# EAGLE board MotherBoard (EAGLE 5.01), part 1 of 2
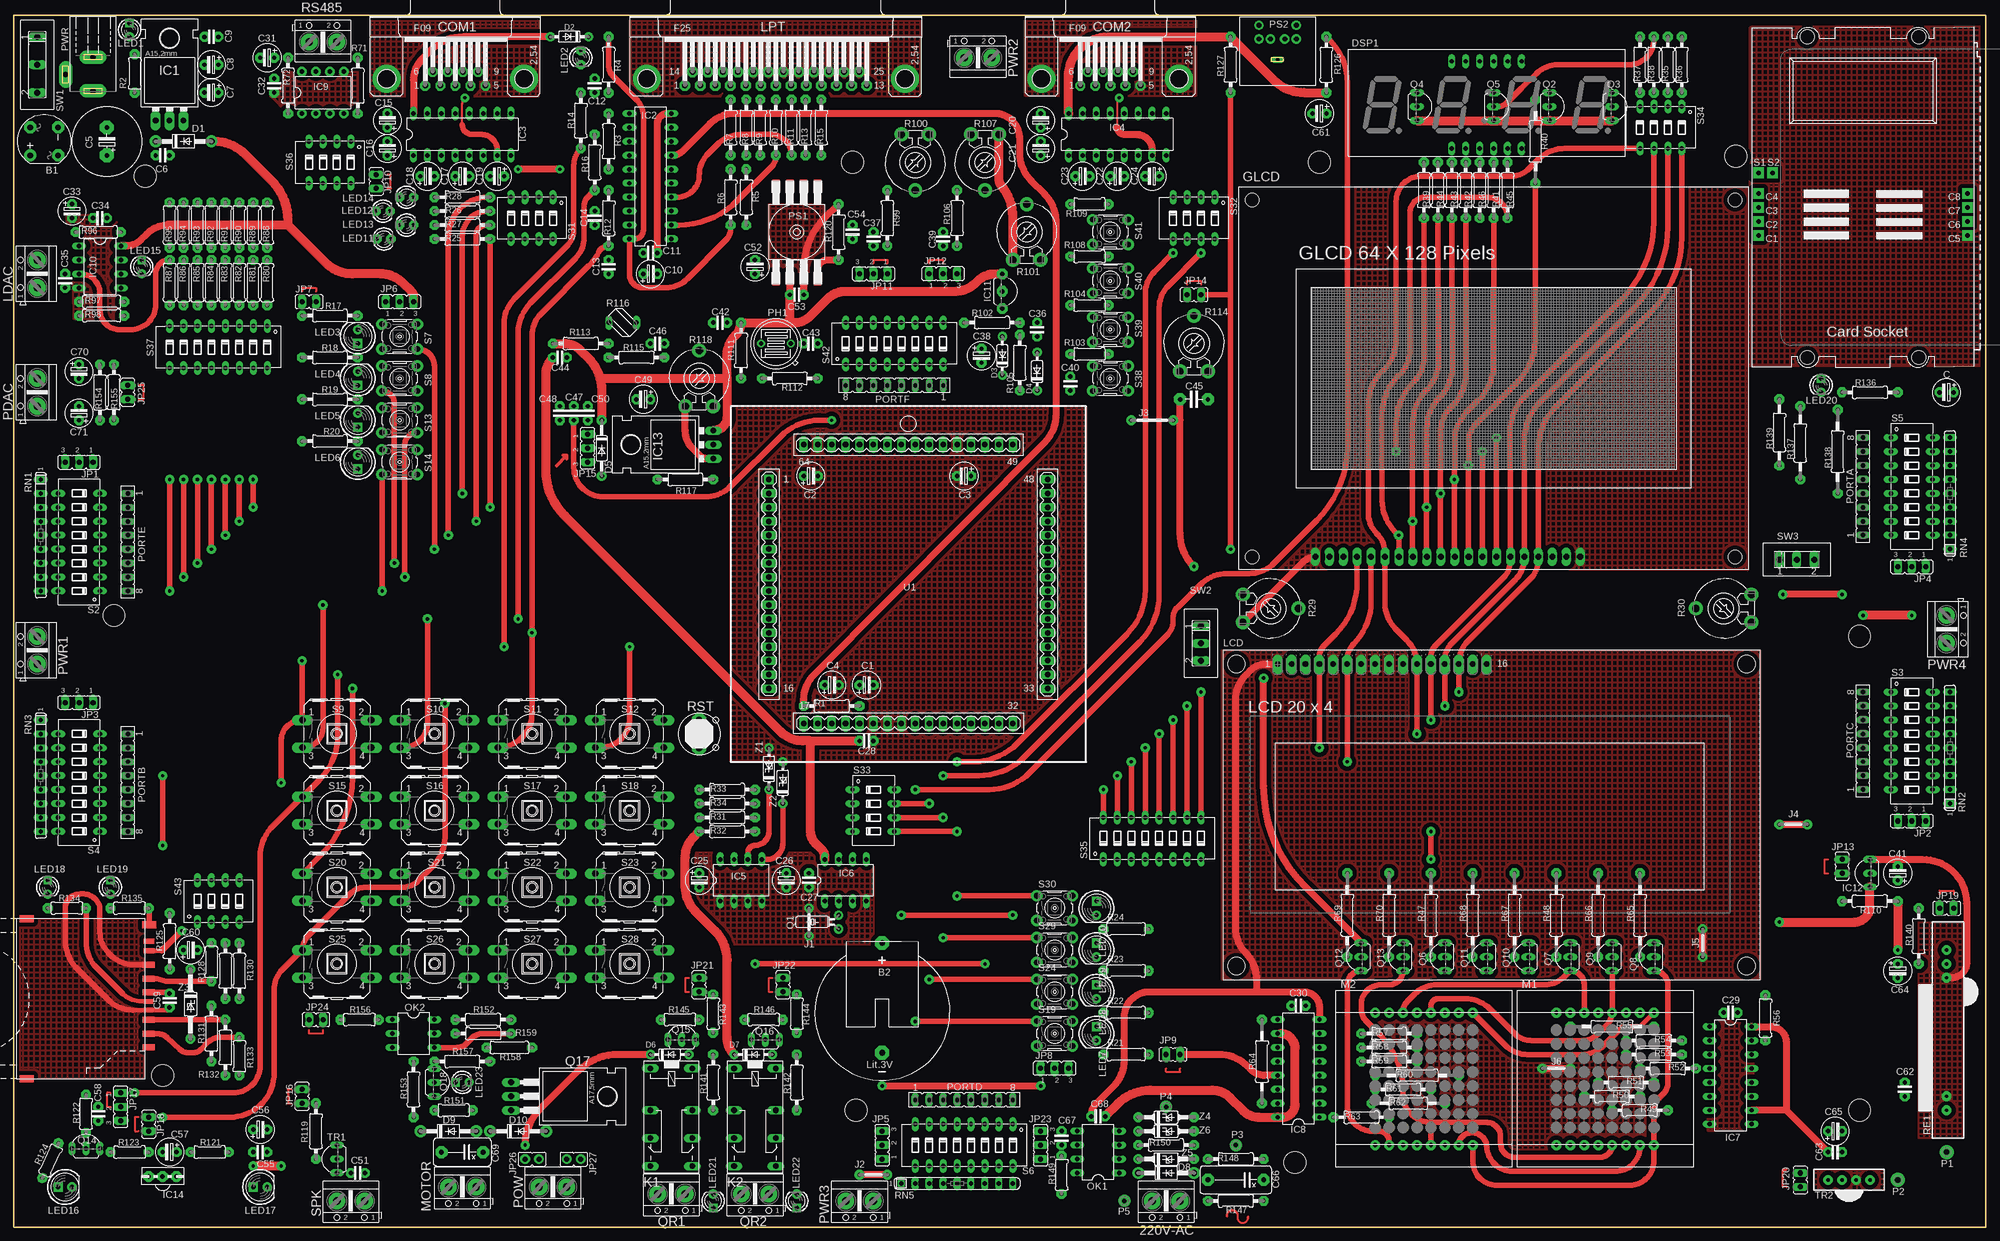
[diagram p18: board, top side]
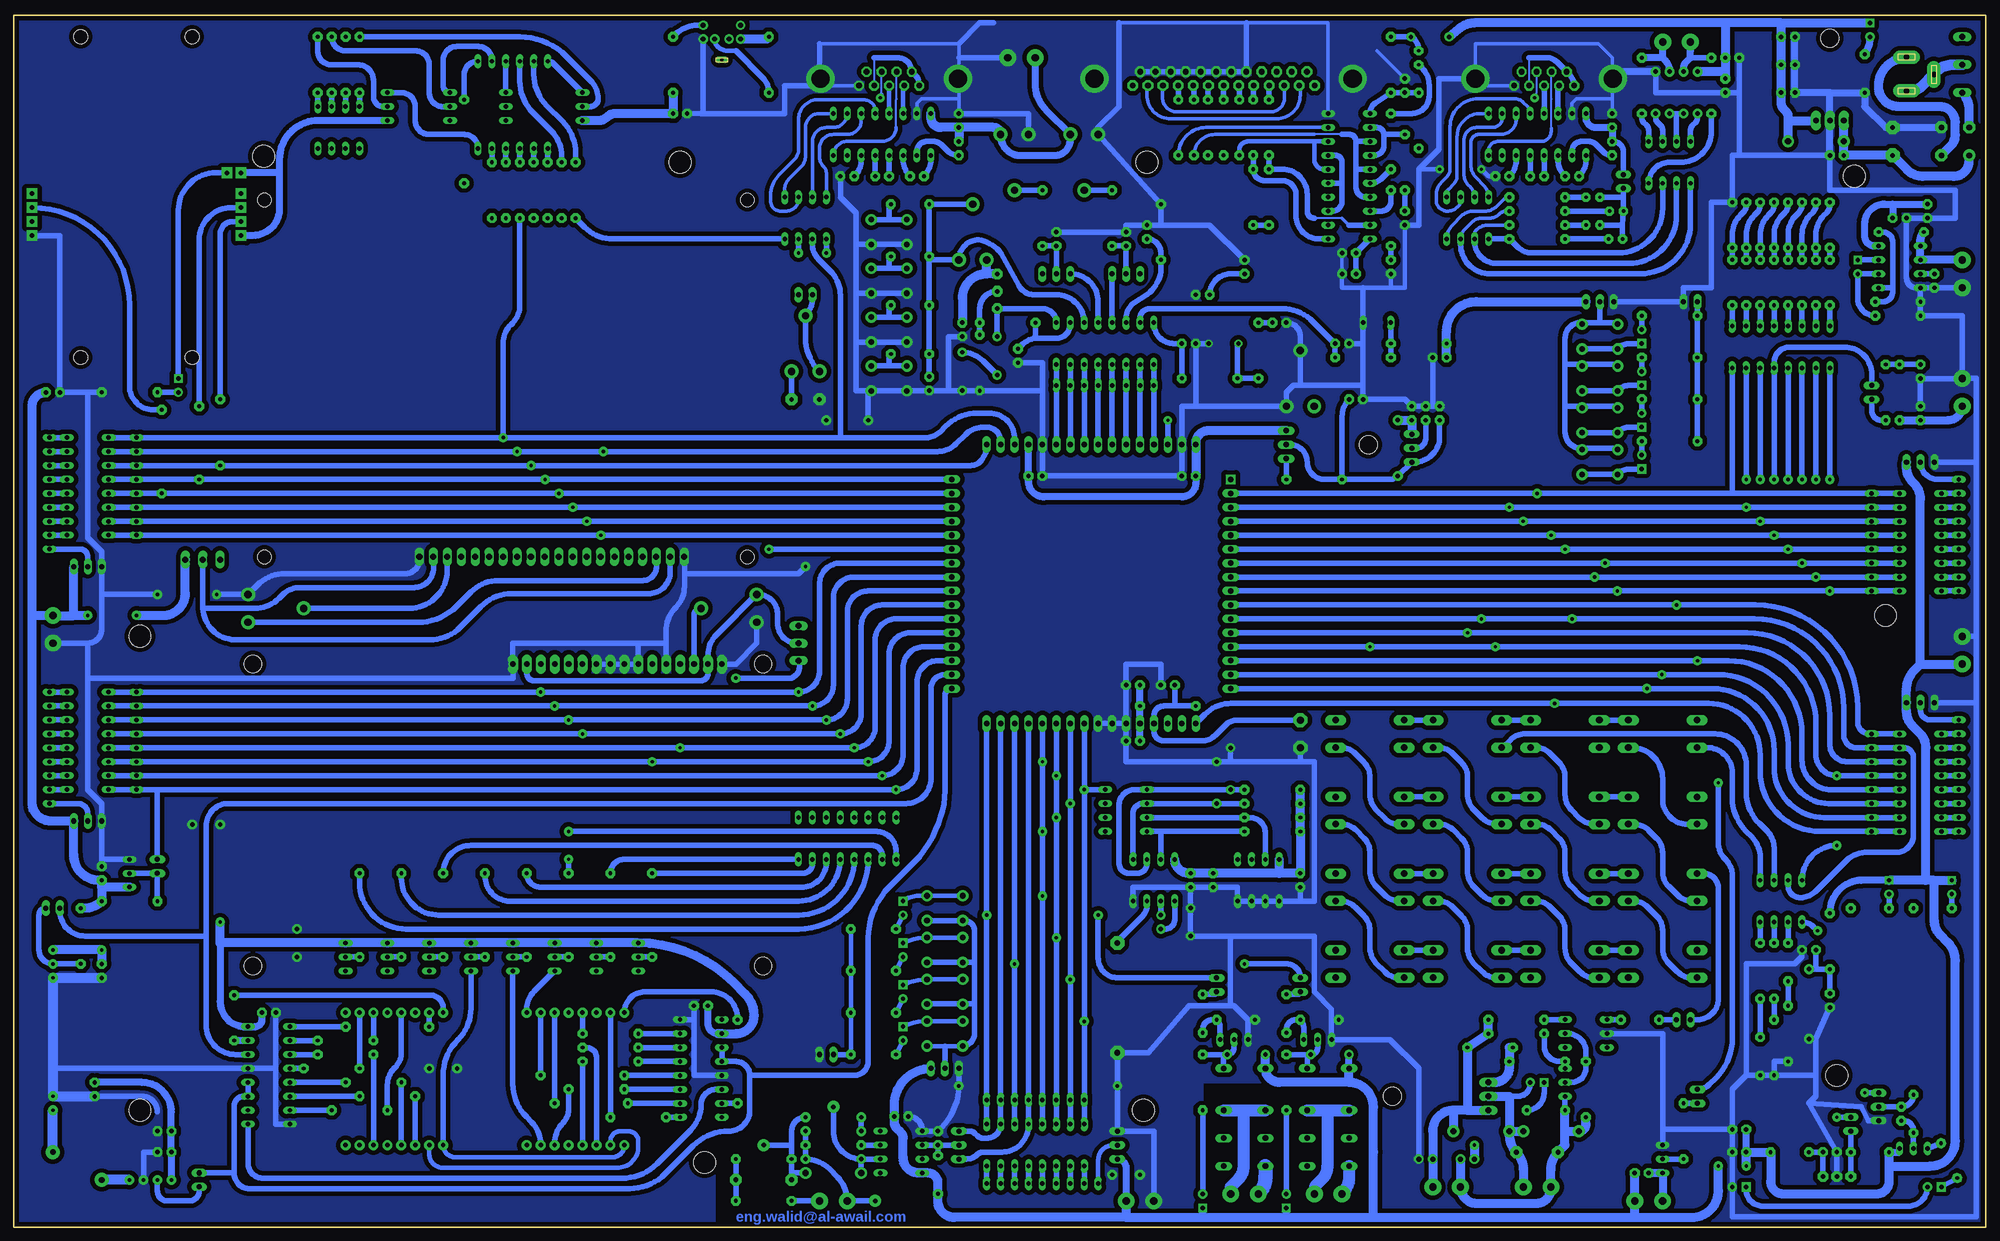
[diagram p19: board, bottom side, seen from below]

Size 359.41 x 220.82 mm. Coordinates in mm from the lower left corner, seen from the top.
Outline: 0.01,220.81 0.01,0.01
Outline: 0,0 359.41,0 359.41,220.82 0,220.82
Copper layers (1*16): Top 0.035mm / dielectric 1.5mm / Bottom 0.035mm
Design rules "default *": minimum track width 32mil, minimum drill 20mil, track to track 8mil, track to pad 8mil, pad to pad 8mil, via to via 8mil, smd to smd 8mil, copper to edge 20mil, drill to drill 8mil, minimum pad ring 10mil, minimum via ring 8mil, stop-mask expansion 4mil, vias tented up to drill 0mil, thermal gap 10mil
Holes 4 mm at 336.39,21.27 336.39,107.63 27.15,27.62 23.97,191.45 18.26,111.44 313.85,195.1 153.51,21.27 233.52,11.75 237.97,193.99 152.88,193.99

## Footprints (pad centres in the part's own frame; a part is rotated, then mirrored left to right if it is on the bottom)
AK500/2 = drill 1.321 pad 3.048 round: 1 -2.515,0; 2 2.515,0
RB1A = drill 1.016 pad 2.184 round: + -2.54,2.54 | drill 1.016 pad 2.184 octagon: - 2.54,-2.54; AC1 2.54,2.54; AC2 -2.54,-2.54
BATT = drill 1.016 pad 2.54 octagon: + 0,10.16; - 0,-9.842
ELC2.5 = drill 0.8 pad 1.778 octagon: 1 -1.27,0; 2 1.27,0
ELC5 = drill 0.8 pad 2.54 octagon: 1 -2.54,0; 2 2.54,0
CAP2.5 = drill 0.8 pad 1.778 octagon: 1 -1.27,0; 2 1.27,0
CAP5 = drill 0.8 pad 2.184 octagon: 1 -2.54,0; 2 2.54,0
CXXC10BS = drill 0.9 pad 2.184 octagon: 1 -5.08,0; 2 5.08,0
CXXC7BS = drill 0.9 pad 2.184 octagon: 1 -5.08,0; 2 2.54,0
F09HP = drill 1.016 pad 1.778 octagon: 1 -5.486,-1.27; 2 -2.743,-1.27; 3 0,-1.27; 4 2.743,-1.27; 5 5.486,-1.27; 6 -4.115,1.27; 7 -1.372,1.27; 8 1.372,1.27; 9 4.115,1.27 | drill 3.302 pad 5.08 round: G1 -12.522,0; G2 12.522,0
DO41-10 = drill 1.118 pad 2.184 round: A 5.08,0; C -5.08,0
DO35-7 = drill 0.813 pad 1.676 round: A 3.175,0; C -3.81,0
DO35-10 = drill 0.813 pad 1.778 round: A 5.08,0; C -5.08,0
DISPLAY-Q0.56 = drill 0.813 long: 1 -6.35,-7.62; 2 -3.81,-7.62; 3 -1.27,-7.62; 4 1.27,-7.62; 5 3.81,-7.62; 6 6.35,-7.62; 7 6.35,8.255; 8 3.81,8.255; 9 1.27,8.255; 10 -1.27,8.255; 11 -3.81,8.255; 12 -6.35,8.255
LCD128X64 = drill 1.1 pad 1.676 long: 1 15.76,-32.5; 2 13.22,-32.5; 3 10.68,-32.5; 4 8.14,-32.5; 5 5.6,-32.5; 6 3.06,-32.5; 7 0.52,-32.5; 8 -2.02,-32.5; 9 -4.56,-32.5; 10 -7.1,-32.5; 11 -9.64,-32.5; 12 -12.18,-32.5; 13 -14.72,-32.5; 14 -17.26,-32.5; 15 -19.8,-32.5; 16 -22.34,-32.5; 17 -24.88,-32.5; 18 -27.42,-32.5; 19 -29.96,-32.5; 20 -32.5,-32.5 | hole 2.5: -44,-32.5; 44,-32.5; -44,32.5; 44,32.5
78XXL = drill 1.016 pad 1.778 long: GND 0,-3.81; IN -2.54,-3.81; OUT 2.54,-3.81 | hole 3.302: 0,11.176
DIL20 = drill 0.813 long: 1 -11.43,-3.81; 2 -8.89,-3.81; 3 -6.35,-3.81; 4 -3.81,-3.81; 5 -1.27,-3.81; 6 1.27,-3.81; 7 3.81,-3.81; 8 6.35,-3.81; 9 8.89,-3.81; 10 11.43,-3.81; 11 11.43,3.81; 12 8.89,3.81; 13 6.35,3.81; 14 3.81,3.81; 15 1.27,3.81; 16 -1.27,3.81; 17 -3.81,3.81; 18 -6.35,3.81; 19 -8.89,3.81; 20 -11.43,3.81
DIL16L = drill 0.813 long: 1 -8.89,-3.81; 2 -6.35,-3.81; 3 -3.81,-3.81; 4 -1.27,-3.81; 5 1.27,-3.81; 6 3.81,-3.81; 7 6.35,-3.81; 8 8.89,-3.81; 9 8.89,3.81; 10 6.35,3.81; 11 3.81,3.81; 12 1.27,3.81; 13 -1.27,3.81; 14 -3.81,3.81; 15 -6.35,3.81; 16 -8.89,3.81
DIL8L = drill 0.813 long: 1 -3.81,-3.81; 2 -1.27,-3.81; 3 1.27,-3.81; 4 3.81,-3.81; 5 3.81,3.81; 6 1.27,3.81; 7 -1.27,3.81; 8 -3.81,3.81
DIL8R = drill 0.813 pad 1.778 round: 1 -3.81,-3.81; 2 -1.27,-3.81; 3 1.27,-3.81; 4 3.81,-3.81; 5 3.81,3.81; 6 1.27,3.81; 7 -1.27,3.81; 8 -3.81,3.81
DIL08 = drill 0.813 long: 1 -3.81,-3.81; 2 -1.27,-3.81; 3 1.27,-3.81; 4 3.81,-3.81; 5 3.81,3.81; 6 1.27,3.81; 7 -1.27,3.81; 8 -3.81,3.81
LM35 = drill 0.813 pad 1.93 octagon: 1 3.175,0; 2 0,0; 3 -3.175,0
TO92L = drill 0.813 long: 1 2.54,0; 2 0,0; 3 -2.54,0
317TL = drill 1.016 long: 1 -2.54,-3.81; 2 0,-3.81; 3 2.54,-3.81 | hole 3.302: 0,11.176
IR-RECEIVER = drill 0.813 pad 1.93 octagon: GND 0,0; OUT 2.54,0; VCC -2.54,0
05 = drill 0.813 pad 1.6 octagon: 1 -2.54,0; 2 2.54,0
05' = drill 0.8 pad 1.778 round: 1 -2.54,0; 2 2.54,0
07 = drill 0.8 pad 1.778 round: 1 -3.81,0; 2 3.81,0
JP2 = drill 0.914 long: 1 -2.54,0; 2 0,0; 3 2.54,0
JP1Y = drill 0.914 long: 1 0,-1.27; 2 0,1.27
JP1 = drill 0.914 pad 1.778 round: 1 0,-1.27; 2 0,1.27
351 = drill 1.016 long: 1 -3.81,-3.81; 16 -3.81,3.81; O1 8.89,-3.81; O2 8.89,3.81; P1 3.81,-3.81; P2 3.81,3.81; S1 13.97,-3.81; S2 13.97,3.81
LCD20X4 = drill 1.016 pad 1.778 long: 1 -38.108,27.947; 2 -35.568,27.947; 3 -33.028,27.947; 4 -30.488,27.947; 5 -27.948,27.947; 6 -25.408,27.947; 7 -22.868,27.947; 8 -20.328,27.947; 9 -17.788,27.947; 10 -15.248,27.947; 11 -12.708,27.947; 12 -10.168,27.947; 13 -7.628,27.947; 14 -5.088,27.947; 15 -2.548,27.947; 16 -0.008,27.947 | hole 3.2: -45.601,27.94; -45.601,-27.067; 47.387,-27.067; 47.387,27.94
LED3MM = drill 0.8 pad 1.524 square: A -1.27,0 | drill 0.8 pad 1.676 round: K 1.27,0
LED3MM' = drill 0.61 pad 1.676 octagon: A -1.27,0; K 1.27,0
LED5MM = drill 0.8 pad 1.676 square: A -1.27,0 | drill 0.8 pad 1.676 round: K 1.27,0
F25HP = drill 1.016 pad 1.93 octagon: 1 -16.561,-1.27; 2 -13.792,-1.27; 3 -11.049,-1.27; 4 -8.28,-1.27; 5 -5.512,-1.27; 6 -2.769,-1.27; 7 0,-1.27; 8 2.769,-1.27; 9 5.512,-1.27; 10 8.28,-1.27; 11 11.049,-1.27; 12 13.792,-1.27; 13 16.561,-1.27; 14 -15.189,1.27; 15 -12.421,1.27; 16 -9.652,1.27; 17 -6.909,1.27; 18 -4.14,1.27; 19 -1.372,1.27; 20 1.372,1.27; 21 4.14,1.27; 22 6.909,1.27; 23 9.652,1.27; 24 12.421,1.27; 25 15.189,1.27 | drill 3.302 pad 5.08 round: G1 -23.52,0; G2 23.52,0
8X8MATRIX-3MM = drill 0.8 pad 1.8 round: 1 -8.89,-11.43; 2 -6.35,-11.43; 3 -3.81,-11.43; 4 -1.27,-11.43; 5 1.27,-11.43; 6 3.81,-11.43; 7 6.35,-11.43; 8 8.89,-11.43; 9 8.89,12.7; 10 6.35,12.7; 11 3.81,12.7; 12 1.27,12.7; 13 -1.27,12.7; 14 -3.81,12.7; 15 -6.35,12.7; 16 -8.89,12.7
DIL06 = drill 0.813 long: 1 -2.54,-3.81; 2 0,-3.81; 3 2.54,-3.81; 4 2.54,3.81; 5 0,3.81; 6 -2.54,3.81
PAD1 = drill 1.016 pad 2.54 round: 1 0,0
PAD0 = drill 0.813 pad 2.184 round: 1 0,0
TO-5_V10 = drill 0.8 pad 1.4 round: 1 -2.7,0; 2 2.7,0
FE08 = drill 0.813 long: 1 -8.89,0; 2 -6.35,0; 3 -3.81,0; 4 -1.27,0; 5 1.27,0; 6 3.81,0; 7 6.35,0; 8 8.89,0
MPXAZ6115A = smd 2.54 x 1.27: 1 8.414,-3.81; 2 8.414,-1.27; 3 8.414,1.27; 4 8.414,3.81; 5 -8.255,3.81; 6 -8.255,1.27; 7 -8.255,-1.27; 8 -8.255,-3.81
PS2-CON = drill 0.9 pad 1.676 round: 1 1.3,8.5; 2 -1.3,8.5; 3 3.4,8.5; 4 -3.4,8.5; 5 3.4,11; 6 -3.4,11 | drill 0.7 long: M 0,4.7
PW = drill 1 pad 2.5 long: + 0,8.57; - 0,2.42; C 5,5.57
TC26 = drill 0.813 pad 1.676 round: 1 -1.27,-5.08; 2 1.27,-5.08
TO220 = drill 1.118 long: 1 -2.54,-6.35; 2 0,-6.35; 3 2.54,-6.35 | hole 3.302: 0,11.176
R-10 = drill 0.7 pad 1.778 octagon: 1 -5.08,0; 2 5.08,0
R-7 = drill 0.7 pad 1.778 octagon: 1 -3.175,0; 2 3.81,0
R-8 = drill 0.7 pad 1.778 octagon: 1 -3.81,0; 2 4.445,0
POT = drill 1.321 pad 2.54 round: A -2.54,-5.08; E 2.54,-5.08; S 0,5.08
R-15 = drill 0.7 pad 1.778 octagon: 1 -7.62,0; 2 7.62,0
R-13 = drill 0.7 pad 1.778 octagon: 1 -6.985,0; 2 6.35,0
B57164 = drill 0.813 long: 1 -2.54,0; 2 2.54,0
R-12 = drill 0.7 pad 1.778 octagon: 1 -5.715,0; 2 6.35,0
GDRX5 = drill 0.6 pad 1.778 round: 1 -12.7,0; 2 -10.16,0; 3 11.43,0; 4 13.97,0; 5 16.51,0
SIL9 = drill 0.813 long: 1 -10.16,0; 2 -7.62,0; 3 -5.08,0; 4 -2.54,0; 5 0,0; 6 2.54,0; 7 5.08,0; 8 7.62,0; 9 10.16,0
SW = drill 1.27 pad 2.54 octagon: 1 -3.785,0; 2 1.245,0
DIP08YL = drill 0.813 long: 1 -8.89,-3.81; 2 -6.35,-3.81; 3 -3.81,-3.81; 4 -1.27,-3.81; 5 1.27,-3.81; 6 3.81,-3.81; 7 6.35,-3.81; 8 8.89,-3.81; 9 8.89,3.81; 10 6.35,3.81; 11 3.81,3.81; 12 1.27,3.81; 13 -1.27,3.81; 14 -3.81,3.81; 15 -6.35,3.81; 16 -8.89,3.81
B3F-10XX = drill 1.016 pad 2.032 round: 1 -3.251,2.261; 2 3.251,2.261; 3 -3.251,-2.261; 4 3.251,-2.261
B3F-40XX = drill 1.194 pad 1.93 long: 1 -6.248,2.489; 2 6.248,2.489; 3 -6.248,-2.489; 4 6.248,-2.489
DIP04YL = drill 0.813 long: 1 -3.81,-3.81; 2 -1.27,-3.81; 3 1.27,-3.81; 4 3.81,-3.81; 5 3.81,3.81; 6 1.27,3.81; 7 -1.27,3.81; 8 -3.81,3.81
MMC-SD-CARD-P = smd 2.184 x 1.067: 1 17.817,-7.619; 2 17.817,-5.119; 4 17.817,-0.119; 5 17.817,2.381; 6 17.817,4.921; 9 17.817,-10.119 | smd 1.676 x 0.813: 3 17.78,-3.334; S2 17.78,-1.746 | smd 1.93 x 0.965: 7 17.817,7.461; 8 17.817,9.207 | smd 2.54 x 1.27: F1 -4.445,13.335; F2 -4.445,-15.875; S1 17.897,12.224
SWITCH = drill 1.118 long: 1 -5.08,0; 2 5.08,0; P 0,0
ON_OFF = drill 1.118 long: 1 -3.175,0; 2 3.175,0; P 0,0
GDTX6 = drill 0.6 pad 1.778 round: 1 3.81,0; 2 1.27,0; 3 -1.27,0; 4 -3.81,0
HEADER64PIN = drill 1.016 pad 1.778 square: 1 -25.4,19.685 | drill 1.016 long: 2 -25.4,17.145; 3 -25.4,14.605; 4 -25.4,12.065; 5 -25.4,9.525; 6 -25.4,6.985; 7 -25.4,4.445; 8 -25.4,1.905; 9 -25.4,-0.635; 10 -25.4,-3.175; 11 -25.4,-5.715; 12 -25.4,-8.255; 13 -25.4,-10.795; 14 -25.4,-13.335; 15 -25.4,-15.875; 16 -25.4,-18.415; 17 -19.05,-24.765; 18 -16.51,-24.765; 19 -13.97,-24.765; 20 -11.43,-24.765; 21 -8.89,-24.765; 22 -6.35,-24.765; 23 -3.81,-24.765; 24 -1.27,-24.765; 25 1.27,-24.765; 26 3.81,-24.765; 27 6.35,-24.765; 28 8.89,-24.765; 29 11.43,-24.765; 30 13.97,-24.765; 31 16.51,-24.765; 32 19.05,-24.765; 33 25.4,-18.415; 34 25.4,-15.875; 35 25.4,-13.335; 36 25.4,-10.795; 37 25.4,-8.255; 38 25.4,-5.715; 39 25.4,-3.175; 40 25.4,-0.635; 41 25.4,1.905; 42 25.4,4.445; 43 25.4,6.985; 44 25.4,9.525; 45 25.4,12.065; 46 25.4,14.605; 47 25.4,17.145; 48 25.4,19.685; 49 19.05,26.035; 50 16.51,26.035; 51 13.97,26.035; 52 11.43,26.035; 53 8.89,26.035; 54 6.35,26.035; 55 3.81,26.035; 56 1.27,26.035; 57 -1.27,26.035; 58 -3.81,26.035; 59 -6.35,26.035; 60 -8.89,26.035; 61 -11.43,26.035; 62 -13.97,26.035; 63 -16.51,26.035; 64 -19.05,26.035
CARDSOCKET = drill 0.813 pad 1.93 square: CLK -19.05,-1.905; GND 19.05,-6.985; I/O 19.05,-1.905; PIN4 -19.05,0.635; PIN6 19.05,-4.445; PIN8 19.05,0.635; RST -19.05,-4.445; SW1 -19.05,4.445; SW2 -16.51,4.445; VCC -19.05,-6.985 | hole 2.54: 10.16,29.21; -10.16,29.21; 10.16,-29.21; -10.16,-29.21
DO35-7B = drill 0.8 pad 1.676 round: A 3.81,0; C -3.81,0
SOD120 = drill 0.8 pad 1.778 round: A 6.35,0; C -6.35,0
SOD81 = drill 0.8 pad 1.778 round: A 5.08,0; C -5.08,0

## Placement (x,y rotation side)
220V-AC  [AK500/2]  210.03,4.76 180 top
B1  [RB1A]  5.56,197.8 90 top
B2  [BATT]  158.27,41.59 0 top
C  1uF  [ELC2.5]  352.27,152.08 180 top
C1  1uF  [ELC2.5]  155.42,98.74 0 top
C2  1uF  [ELC2.5]  145.26,136.84 0 top
C3  1uF  [ELC2.5]  173.2,136.84 180 top
C4  1uF  [ELC2.5]  149.07,98.74 0 top
C5  1000uF  [ELC5]  16.99,197.8 90 top
C6  100nF  [CAP2.5]  27.15,195.26 180 top
C7  100uF  [ELC2.5]  36.04,206.69 180 top
C8  10uF  [ELC2.5]  36.04,211.77 180 top
C9  100nF  [CAP2.5]  36.04,216.85 0 top
C10  100nF  [CAP2.5]  116.05,177.48 180 top
C11  1uF  [ELC2.5]  116.05,173.67 0 top
C12  100pF  [CAP2.5]  105.89,207.96 270 top
C13  100pF  [CAP2.5]  108.43,174.94 90 top
C14  100pF  [CAP2.5]  105.89,183.83 90 top
C15  1uF  [ELC2.5]  68.1,201.61 90 top
C16  1uF  [ELC2.5]  68.1,196.53 90 top
C17  1uF  [ELC2.5]  81.76,191.45 0 top
C18  1uF  [ELC2.5]  75.41,191.45 0 top
C19  1uF  [ELC2.5]  88.11,191.45 180 top
C20  1uF  [ELC2.5]  187.17,201.61 90 top
C21  1uF  [ELC2.5]  187.17,196.53 90 top
C22  1uF  [ELC2.5]  201.14,191.45 0 top
C23  1uF  [ELC2.5]  194.79,191.45 0 top
C24  1uF  [ELC2.5]  207.49,191.45 180 top
C25  1uF  [ELC2.5]  124.94,63.18 270 top
C26  100nF  [CAP2.5]  144.94,63.18 90 top
C27  1uF  [ELC2.5]  140.81,63.18 270 top
C28  100nF  [CAP2.5]  155.42,88.58 0 top
C29  100nF  [CAP2.5]  312.9,39.05 0 top
C30  100nF  [CAP2.5]  234.16,40.32 180 top
C31  1uF  [ELC2.5]  46.2,213.04 180 top
C32  100nF  [CAP2.5]  47.47,207.96 90 top
C33  1uF  [ELC2.5]  10.64,185.1 270 top
C34  100nF  [CAP2.5]  15.72,183.83 0 top
C35  100pF  [CAP2.5]  9.37,172.4 90 top
C36  100nF  [CAP2.5]  186.53,163.51 270 top
C37  100nF  [CAP2.5]  156.69,180.02 270 top
C38  1uF  [ELC2.5]  176.37,158.75 270 top
C39  100nF  [CAP2.5]  169.39,180.02 270 top
C40  100nF  [CAP2.5]  192.56,153.67 90 top
C41  1uF  [ELC2.5]  343.38,64.45 90 top
C42  100nF  [CAP2.5]  128.75,164.78 0 top
C43  100nF  [CAP2.5]  145.26,160.97 0 top
C44  100nF  [CAP2.5]  99.54,158.43 180 top
C45  100nF  [CAP5]  215.11,150.81 0 top
C46  100nF  [CAP2.5]  117.32,160.97 0 top
C47  100nF  [CAP2.5]  102.08,148.27 270 top
C48  100nF  [CAP2.5]  99.54,148.27 270 top
C49  1uF  [ELC2.5]  114.78,150.81 180 top
C50  100nF  [CAP2.5]  104.62,148.27 270 top
C51  100nF  [CAP2.5]  62.71,9.84 0 top
C52  1uF  [ELC2.5]  135.1,174.94 90 top
C53  100nF  [CAP2.5]  142.72,169.86 180 top
C54  47nF  [CAP2.5]  152.88,181.29 270 top
C55  100nF  [CAP2.5]  44.93,13.65 180 top
C56  10uF  [ELC2.5]  44.93,17.78 0 top
C57  4.7uF  [ELC2.5]  28.42,13.65 180 top
C58  10nF  [CAP2.5]  15.4,20.64 270 top
C59  100nF  [CAP2.5]  28.42,41.28 90 top
C60  1uF  [ELC2.5]  32.23,50.48 0 top
C61  1uF  [ELC2.5]  237.97,202.88 180 top
C62  100nF  [CAP2.5]  344.65,25.08 270 top
C63  100nF  [CAP2.5]  331.95,13.65 0 top
C64  4.7uF  [ELC2.5]  343.38,46.67 270 top
C65  4.7uF  [ELC2.5]  331.95,17.46 0 top
C66  0.47uF/250V  [CXXC10BS]  222.73,8.57 180 top
C67  27pF  [CAP2.5]  190.98,16.19 270 top
C68  100nF  [CAP2.5]  197.64,20.16 180 top
C69  100nF  [CXXC7BS]  80.49,13.65 180 top
C70  ?  [ELC2.5]  11.91,155.89 270 top
C71  ?  [ELC2.5]  11.91,148.27 90 top
COM1  [F09HP]  80.49,209.23 0 top
COM2  [F09HP]  199.87,209.23 0 top
D1  1N4004  [DO41-10]  30.96,197.8 0 top
D2  1N4148-7  [DO35-7]  100.97,216.85 180 top
D3  1N4148  [DO35-7]  180.18,159.07 90 top
D4  1N4148  [DO35-7]  186.53,156.21 90 top
D5  1N4148  [DO35-10]  107.16,141.92 270 top
D6  1N4148-7  [DO35-7]  119.86,31.43 0 top
D7  1N4148-7  [DO35-7]  135.1,31.43 0 top
D8  1N4004  [DO41-10]  210.03,9.84 0 top
D9  1N4004  [DO41-10]  79.22,17.46 0 top
D10  1N4004  [DO41-10]  91.92,17.46 0 top
DSP1  [DISPLAY-Q0.56]  268.45,204.15 0 top
GLCD  [LCD128X64]  269.72,154.62 0 top
IC1  7805  [78XXL]  28.42,205.42 0 top
IC2  74LS244N  [DIL20]  116.05,191.45 90 top
IC3  MAX232  [DIL16L]  81.76,199.07 0 top
IC4  MAX232  [DIL16L]  201.14,199.07 0 top
IC5  24C512  [DIL8L]  132.56,63.18 0 top
IC6  DS1307  [DIL8L]  151.61,63.18 0 top
IC7  74HC595  [DIL16L]  312.9,27.62 270 top
IC8  74HC595  [DIL16L]  234.16,28.89 90 top
IC9  MAX484  [DIL8R]  56.36,206.69 0 top
IC10  LM358N  [DIL08]  15.72,174.94 270 top
IC11  LM35  [LM35]  180.18,170.5 90 top
IC12  DS1820  [TO92L]  338.3,64.45 90 top
IC13  LM7317  [317TL]  123.67,142.56 90 top
IC14  [IR-RECEIVER]  27.15,9.21 180 top
J1  J5MM  [05]  144.94,55.56 90 top
J2  [05']  156.69,9.53 0 top
J3  [07]  207.49,147 0 top
J4  [05']  324.33,73.34 0 top
J5  [05']  307.82,51.75 90 top
J6  [05']  281.15,28.89 0 top
JP1  [JP2]  11.91,139.38 180 top
JP2  [JP2]  345.92,73.98 180 top
JP3  [JP2]  11.91,95.57 180 top
JP4  [JP2]  345.92,120.33 180 top
JP5  [JP2]  158.27,14.92 90 top
JP6  [JP2]  70.33,168.59 0 top
JP7  [JP1Y]  53.82,168.59 270 top
JP8  [JP2]  189.71,28.89 0 top
JP9  [JP1Y]  211.3,31.43 270 top
JP10  [JP1Y]  66.04,190.5 0 top
JP11  [JP2]  156.69,173.67 180 top
JP12  [JP2]  169.39,173.67 0 top
JP13  [JP1Y]  333.22,65.72 0 top
JP14  [JP1Y]  215.11,169.86 270 top
JP15  [JP2]  104.62,141.92 270 top
JP16  [JP1Y]  52.55,23.81 180 top
JP17  [JP2]  19.53,21.91 270 top
JP18  [JP1Y]  24.61,18.73 0 top
JP19  [JP1Y]  352.27,58.1 90 top
JP20  [JP1Y]  325.6,8.57 0 top
JP21  [JP1Y]  124.94,44.13 180 top
JP22  [JP1Y]  140.18,44.13 180 top
JP23  [JP2]  187.17,14.92 90 top
JP24  [JP1Y]  55.09,37.78 270 top
JP25  [JP1Y]  20.8,152.08 180 top
JP26  [JP1]  94.46,12.38 90 top
JP27  [JP1]  102.08,12.38 90 top
K1  351  [351]  119.86,25.08 270 top
K2  351  [351]  135.1,25.08 270 top
LCD  [LCD20X4]  268.45,74.61 0 top
LDAC  [AK500/2]  4.29,173.67 90 top
LED1  [LED3MM]  21.11,218.12 270 top
LED2  [LED3MM']  103.35,213.04 270 top
LED3  [LED5MM]  62.71,162.24 90 top
LED4  [LED5MM]  62.71,154.62 90 top
LED5  [LED5MM]  62.71,147 90 top
LED6  [LED5MM]  62.71,139.38 90 top
LED7  [LED5MM]  197.33,35.24 270 top
LED8  [LED5MM]  197.33,42.86 270 top
LED9  [LED5MM]  197.33,50.48 270 top
LED10  [LED5MM]  197.33,58.1 270 top
LED11  [LED3MM']  67.47,180.02 0 top
LED12  [LED3MM']  67.31,185.1 0 top
LED13  [LED3MM']  71.6,182.56 0 top
LED14  [LED3MM']  71.6,187.64 0 top
LED15  [LED3MM]  23.34,174.94 270 top
LED16  [LED5MM]  9.37,7.3 0 top
LED17  [LED5MM]  44.93,7.3 0 top
LED18  [LED3MM]  6.19,61.91 270 top
LED19  [LED3MM]  17.62,61.91 270 top
LED20  [LED3MM]  329.41,153.35 270 top
LED21  [LED3MM]  127.48,4.76 90 top
LED22  [LED3MM]  142.72,4.76 90 top
LED23  [LED3MM]  81.76,26.35 0 top
LPT  [F25HP]  138.91,209.23 0 top
M1  [8X8MATRIX-3MM]  290.04,26.35 0 top
M2  [8X8MATRIX-3MM]  257.02,26.35 0 top
MOTOR  [AK500/2]  81.76,7.3 180 top
OK1  6N137  [DIL08]  197.64,13.65 90 top
OK2  4N35  [DIL06]  72.87,35.24 270 top
P1  [PAD1]  352.27,13.65 180 top
P2  [PAD1]  343.38,8.57 180 top
P3  [PAD0]  222.73,14.92 0 top
P4  [PAD0]  210.03,21.91 0 top
P5  [PAD0]  202.41,4.76 0 top
PDAC  [AK500/2]  4.29,152.08 90 top
PH1  100K  [TO-5_V10]  138.91,160.97 0 top
PORTA  [FE08]  337.03,134.94 90 top
PORTB  [FE08]  20.8,80.96 270 top
PORTC  [FE08]  337.03,88.58 90 top
PORTD  [FE08]  173.2,23.18 0 top
PORTE  [FE08]  20.8,124.78 270 top
PORTF  [FE08]  160.5,153.35 180 top
POW  [AK500/2]  98.27,7.3 180 top
PS1  [MPXAZ6115A]  142.72,181.29 270 top
PS2  [PS2-CON]  230.35,207.96 0 top
PWR  [PW]  14.45,215.58 180 top
PWR1  [AK500/2]  4.29,105.09 90 top
PWR2  [AK500/2]  175.74,213.04 0 top
PWR3  [AK500/2]  154.15,4.76 180 top
PWR4  [AK500/2]  352.27,108.9 270 top
Q1  32KHZ  [TC26]  145.26,55.56 90 top
Q2  BC327  [TO92L]  279.88,204.15 270 top
Q3  BC327  [TO92L]  291.31,204.15 270 top
Q4  BC327  [TO92L]  255.75,204.15 270 top
Q5  BC327  [TO92L]  269.72,204.15 270 top
Q6  [TO92L]  260.83,49.21 90 top
Q7  [TO92L]  283.69,49.21 90 top
Q8  [TO92L]  298.93,49.21 90 top
Q9  [TO92L]  291.31,49.21 90 top
Q10  [TO92L]  276.07,49.21 90 top
Q11  [TO92L]  268.45,49.21 90 top
Q12  [TO92L]  245.59,49.21 90 top
Q13  [TO92L]  253.21,49.21 90 top
Q14  BC327  [TO92L]  13.18,14.29 0 top
Q15  [TO92L]  121.76,34.13 0 top
Q16  [TO92L]  137,34.13 0 top
Q17  IRF540  [TO220]  97,23.81 270 top
Q18  [TO92L]  76.68,26.35 270 top
QR1  [AK500/2]  119.86,6.03 180 top
QR2  [AK500/2]  135.1,6.03 180 top
R1  10K  [R-10]  149.07,94.93 180 top
R2  300  [R-7]  22.07,209.87 90 top
R3  300  [R-10]  108.43,197.8 90 top
R4  100K  [R-10]  108.43,211.77 90 top
R5  100K  [R-10]  133.51,187.64 270 top
R6  100K  [R-10]  130.65,187.64 270 top
R7  300  [R-10]  130.65,200.34 270 top
R8  300  [R-10]  133.51,200.34 270 top
R9  300  [R-10]  136.05,200.34 270 top
R10  300  [R-10]  138.91,200.34 270 top
R11  300  [R-10]  141.76,200.34 270 top
R12  300  [R-10]  108.43,183.83 270 top
R13  300  [R-10]  144.3,200.34 270 top
R14  300  [R-10]  103.35,201.61 270 top
R15  150  [R-10]  147.16,200.34 270 top
R16  300  [R-10]  105.89,193.99 270 top
R17  300  [R-10]  57.63,166.05 180 top
R18  300  [R-10]  57.63,158.43 180 top
R19  300  [R-10]  57.63,150.81 180 top
R20  300  [R-10]  57.63,143.19 180 top
R21  300  [R-8]  202.41,31.43 0 top
R22  300  [R-8]  202.41,39.05 0 top
R23  300  [R-8]  202.41,46.67 0 top
R24  300  [R-8]  202.41,54.29 0 top
R25  560  [R-10]  81.76,180.02 180 top
R26  560  [R-10]  81.76,185.1 180 top
R27  560  [R-10]  81.76,182.56 180 top
R28  560  [R-10]  81.76,187.64 180 top
R29  10K  [POT]  229.08,112.71 270 top
R30  10K  [POT]  311.63,112.71 90 top
R31  10K  [R-10]  130.02,74.61 180 top
R32  4K7  [R-10]  130.02,72.07 180 top
R33  1K5  [R-10]  130.02,79.69 180 top
R34  1K5  [R-10]  130.02,77.15 180 top
R35  4K7  [R-10]  301.47,211.77 270 top
R36  4K7  [R-10]  304.01,211.77 270 top
R37  4K7  [R-10]  296.39,211.77 270 top
R38  4K7  [R-10]  298.93,211.77 270 top
R39  150  [R-10]  257.02,188.91 90 top
R40  150  [R-15]  277.34,197.8 90 top
R41  150  [R-10]  269.72,188.91 90 top
R42  150  [R-10]  264.64,188.91 90 top
R43  150  [R-10]  262.1,188.91 90 top
R44  150  [R-10]  259.56,188.91 90 top
R45  150  [R-10]  272.26,188.91 90 top
R46  150  [R-10]  267.18,188.91 90 top
R47  2K2  [R-15]  258.29,56.83 270 top
R48  2K2  [R-15]  281.15,56.83 270 top
R49  10  [R-10]  296.39,21.27 0 top
R50  10  [R-10]  291.31,23.81 0 top
R51  10  [R-10]  293.85,26.35 0 top
R52  10  [R-10]  301.47,28.89 0 top
R53  10  [R-10]  298.93,31.43 0 top
R54  10  [R-10]  298.93,33.97 0 top
R55  10  [R-15]  291.31,36.51 0 top
R56  10  [R-8]  319.25,38.42 270 top
R57  10  [R-10]  250.67,35.24 180 top
R58  10  [R-10]  250.67,32.7 180 top
R59  10  [R-10]  250.67,30.16 180 top
R60  10  [R-15]  255.75,27.62 180 top
R61  10  [R-10]  253.21,25.08 180 top
R62  10  [R-13]  253.84,22.54 180 top
R63  10  [R-10]  245.59,20 180 top
R64  10  [R-15]  227.49,30.16 270 top
R65  2K2  [R-15]  296.39,56.83 270 top
R66  2K2  [R-15]  288.77,56.83 270 top
R67  2K2  [R-15]  273.53,56.83 270 top
R68  2K2  [R-15]  265.91,56.83 270 top
R69  2K2  [R-15]  243.05,56.83 270 top
R70  2K2  [R-15]  250.67,56.83 270 top
R71  120  [R-10]  62.71,207.96 90 top
R72  0  [R-10]  50.01,207.96 90 top
R80  20K  [R-8]  46.2,172.4 270 top
R81  20K  [R-8]  43.66,172.4 270 top
R82  20K  [R-8]  41.12,172.4 270 top
R83  20K  [R-8]  38.58,172.4 270 top
R84  20K  [R-8]  36.04,172.4 270 top
R85  20K  [R-8]  33.5,172.4 270 top
R86  20K  [R-8]  30.96,172.4 270 top
R87  20K  [R-8]  28.42,172.4 270 top
R88  20K  [R-8]  46.2,182.88 270 top
R89  10K  [R-8]  43.66,182.88 270 top
R90  10K  [R-8]  41.12,182.88 270 top
R91  10K  [R-8]  38.58,182.88 270 top
R92  10K  [R-8]  36.04,182.88 270 top
R93  10K  [R-8]  33.5,182.88 270 top
R94  10K  [R-8]  30.96,182.88 270 top
R95  10K  [R-8]  28.42,182.88 270 top
R96  20K  [R-8]  15.72,181.29 180 top
R97  20K  [R-8]  15.72,168.59 0 top
R98  20K  [R-8]  15.72,166.05 0 top
R99  1K  [R-10]  159.23,183.83 90 top
R100  10K  [POT]  164.31,193.99 180 top
R101  10K  [POT]  184.63,181.29 0 top
R102  100  [R-10]  178.28,164.78 180 top
R103  1K  [R-7]  196.37,159.07 180 top
R104  2K2  [R-7]  196.37,167.96 180 top
R105  18K  [R-10]  183.36,157.48 270 top
R106  1K  [R-10]  171.93,183.83 90 top
R107  10K  [POT]  177.01,193.99 180 top
R108  6K8  [R-7]  196.37,176.85 180 top
R109  15K  [R-7]  196.37,186.37 180 top
R110  4K7  [R-10]  338.3,59.37 0 top
R111  10K  [R-10]  132.56,159.7 90 top
R112  390  [R-10]  141.45,154.62 0 top
R113  5K6  [R-10]  103.35,160.97 180 top
R114  10K  [POT]  215.11,160.97 0 top
R115  390  [R-10]  113.51,158.43 0 top
R116  NTC  [B57164]  110.97,164.78 180 top
R117  1K  [R-10]  122.4,136.21 180 top
R118  10K  [POT]  124.94,154.62 0 top
R119  1K  [R-10]  55.09,17.46 270 top
R120  51K  [R-10]  150.34,181.29 270 top
R121  100  [R-7]  36.04,13.65 180 top
R122  10K  [R-7]  13.18,20.96 270 top
R123  10K  [R-7]  21.43,13.65 180 top
R124  10  [R-7]  6.83,12.38 245 top
R125  100  [R-10]  28.42,52.07 90 top
R126  4K7  [R-10]  239.24,211.77 270 top
R127  4K7  [R-10]  221.77,211.77 90 top
R128  2K2  [R-7]  36.04,47.94 90 top
R129  2K2  [R-10]  38.58,46.67 90 top
R130  2K2  [R-10]  41.12,46.67 90 top
R131  3K3  [R-10]  36.04,35.24 90 top
R132  3K3  [R-10]  38.58,32.7 90 top
R133  3K3  [R-7]  41.12,30.8 90 top
R134  330  [R-7]  9.37,58.1 0 top
R135  330  [R-7]  20.8,58.1 0 top
R136  300  [R-10]  338.3,152.08 180 top
R137  0  [R-13]  325.6,142.56 270 top
R138  0  [R-15]  332.42,141.29 270 top
R139  0  [R-12]  321.79,145.1 270 top
R140  22K  [R-10]  347.19,53.02 270 top
R141  300  [R-10]  127.48,26.35 270 top
R142  300  [R-10]  142.72,26.35 270 top
R143  1K  [R-7]  127.48,39.21 270 top
R144  1K  [R-7]  142.72,39.21 270 top
R145  1K  [R-7]  121.13,37.78 0 top
R146  1K  [R-7]  136.37,37.78 0 top
R147  1K/1W  [R-10]  222.73,4.76 0 top
R148  1M  [R-10]  222.73,12.38 180 top
R149  2K2  [R-7]  190.98,9.84 270 top
R150  150  [R-10]  210.03,14.92 180 top
R151  1K  [R-7]  80.49,21.27 180 top
R152  100K  [R-10]  85.57,37.78 0 top
R153  10K  [R-10]  72.87,25.08 270 top
R154  ?  [R-10]  18.26,152.08 90 top
R155  ?  [R-10]  15.72,152.08 270 top
R156  220  [R-7]  62.71,37.78 0 top
R157  100\  [R-10]  81.76,30.16 0 top
R158  100K  [R-8]  90.65,32.7 180 top
R159  1K  [R-10]  85.57,35.24 180 top
RE1  [GDRX5]  352.27,33.97 90 top
RN1  [SIL9]  4.92,126.05 270 top
RN2  [SIL9]  352.9,87.31 90 top
RN3  [SIL9]  4.92,82.23 270 top
RN4  [SIL9]  352.9,133.67 90 top
RN5  [SIL9]  171.93,7.94 0 top
RS485  [AK500/2]  56.36,215.9 0 top
RST  TAC_SW_S  [SW]  124.94,88.58 270 top
S2  [DIP08YL]  11.91,124.78 90 top
S3  [DIP08YL]  345.92,88.58 270 top
S4  [DIP08YL]  11.91,80.96 90 top
S5  [DIP08YL]  345.92,134.94 270 top
S6  [DIP08YL]  173.2,14.92 180 top
S7  [B3F-10XX]  70.33,162.24 180 top
S8  [B3F-10XX]  70.33,154.62 180 top
S9  [B3F-40XX]  58.9,89.85 0 top
S10  [B3F-40XX]  76.68,89.85 0 top
S11  [B3F-40XX]  94.46,89.85 0 top
S12  [B3F-40XX]  112.24,89.85 0 top
S13  [B3F-10XX]  70.33,147 180 top
S14  [B3F-10XX]  70.33,139.38 180 top
S15  [B3F-40XX]  58.9,75.88 0 top
S16  [B3F-40XX]  76.68,75.88 0 top
S17  [B3F-40XX]  94.46,75.88 0 top
S18  [B3F-40XX]  112.24,75.88 0 top
S19  [B3F-10XX]  189.71,35.24 0 top
S20  [B3F-40XX]  58.9,61.91 0 top
S21  [B3F-40XX]  76.68,61.91 0 top
S22  [B3F-40XX]  94.46,61.91 0 top
S23  [B3F-40XX]  112.24,61.91 0 top
S24  [B3F-10XX]  189.71,42.86 0 top
S25  [B3F-40XX]  58.9,47.94 0 top
S26  [B3F-40XX]  76.68,47.94 0 top
S27  [B3F-40XX]  94.46,47.94 0 top
S28  [B3F-40XX]  112.24,47.94 0 top
S29  [B3F-10XX]  189.71,50.48 0 top
S30  [B3F-10XX]  189.71,58.1 0 top
S31  [DIP04YL]  94.46,183.83 180 top
S32  [DIP04YL]  215.11,183.83 180 top
S33  [DIP04YL]  156.69,75.88 270 top
S34  [DIP04YL]  300.2,200.34 180 top
S35  [DIP08YL]  207.49,70.8 0 top
S36  [DIP04YL]  57.63,193.99 180 top
S37  [DIP08YL]  37.31,160.34 180 top
S38  [B3F-10XX]  199.87,154.62 0 top
S39  [B3F-10XX]  199.87,163.51 0 top
S40  [B3F-10XX]  199.87,172.4 0 top
S41  [B3F-10XX]  199.87,181.29 0 top
S42  [DIP08YL]  160.5,160.97 0 top
S43  [DIP04YL]  37.31,59.37 0 top
S44  [MMC-SD-CARD-P]  6.83,42.86 0 top
SPK  [AK500/2]  61.44,4.76 180 top
SW1  [SWITCH]  4.29,211.77 270 top
SW2  [ON_OFF]  216.38,106.36 270 top
SW3  [ON_OFF]  324.96,121.6 0 top
TR1  [TO92L]  58.9,12.38 90 top
TR2  [GDTX6]  334.49,8.57 0 top
U1  [HEADER64PIN]  163.04,116.52 0 top
U$1  SMARTCARD  [CARDSOCKET]  337.03,187.64 0 top
Z1  4V7  [DO35-7B]  137.64,83.5 90 top
Z2  4V7  [DO35-7B]  140.18,80.96 90 top
Z3  3V3  [SOD120]  32.23,40.64 270 top
Z4  12V  [SOD81]  210.03,20 0 top
Z5  5V1  [SOD81]  210.03,12.38 0 top
Z6  12V  [SOD81]  210.03,17.46 0 top

## Tracks (layer width: path | path; a pad name or v marks a point on that pad's centre or on a via)
+3V3
  Top 1.016: S44.4 28.22,42.74 C59.2
  Bottom 1.016: 30.96,46.99 Z3.C | 30.96,46.99 R125.1 C59.2 | C60.1 30.96,46.99
+VIR
  Bottom 1.016: IC14.VCC C57.1 R121.2
AR1
  Bottom 1.016: S36.8 arc90 57.63,193.99 55.69,193.99 arc-90 50.01,199.67 R72.1
AR2
  Bottom 1.016: S36.1 61.44,199.82 arc-45 61.81,200.71 62.33,201.24 arc45 62.71,202.14 R71.1
AR11
  Bottom 1.016: R72.2 53.82,213.04
  Bottom 1.27: IC9.7 55.09,211.25 arc45 54.71,212.14 53.82,213.04 53.82,214.31 RS485.1
ASAS
  Bottom 1.016: R122.1 arc90 C58.1 JP17.2
BC-CLK
  Bottom 1.016: R137.1 325.6,179.88 arc90 319.74,185.74 U$1.CLK
BC-IO
  Bottom 1.016: R138.1 334.34,148.91 arc90 338.3,153.66 338.3,167.96 arc-90 U$1.I/O
BC-OK
  Bottom 1.016: LED20.A 329.41,185.22 arc90 322.54,192.09 U$1.SW2
BC-RST
  Bottom 1.016: R139.1 321.79,180.91 arc90 319.5,183.2 U$1.RST
CTR
  Bottom 1.016: LCD.3 235.42,111.45 arc90 R29.S
GETRC
  Bottom 1.016: R114.A arc45 215.11,162.02 R114.S arc-45 213.84,169.12 JP14.1
GLCD-V0
  Bottom 1.016: GLCD.3 280.4,119.68 arc90 287.36,112.71 R30.S
GLCD-VOUT
  Bottom 1.016: GLCD.18 242.3,122.19 242.25,122.24 242.25,120.33 arc90 244.79,117.79 271.09,117.79 arc-45 276.06,115.73 278.69,113.1 arc45 285.77,110.17 R30.A
GND  (via drill 0.6 pad 1.52, 0.6 pad 1.68)
  Top 0.813: C59.1 27.94,39.53 S44.3 21.66,39.53
  Top 1.016: 21.66,39.53 arc-45 17.21,41.37 11.63,46.95 arc-45 9.37,52.41 9.37,58.1 arc-90 11.91,60.64 arc-90 15.72,58.1 15.72,53.6 arc45 17.21,50 17.7,49.5 arc45 21.85,47.78 S44.6 | GLCD.20 237.33,122.24 | 212.57,147 J3.2
  Top 1.27: C10.1 117.32,201.07 arc-90 119.13,202.88 IC2.10 | R120.1 147.72,183.76 arc45 143.99,174.74 PS1.3 C53.1 | v333.22,115.25 v322.42,115.25 | IC12.1 347.91,66.99 arc-90 355.92,58.98 355.92,48.17 arc-90 353.15,45.4 RE1.3 | R29.E 235.05,121.22 arc-45 GLCD.20 | C68.2 arc-45 197.38,22.6 200.55,25.76 arc45 202.41,30.25 202.41,38.28 arc-90 206.99,42.86 226.54,42.86 | 226.54,42.86 235.13,42.86 arc-90 237.97,40.02 IC8.8 | IC8.13 228.02,27.62 arc-45 225.48,28.67 224.9,29.26 arc45 219.66,31.43 JP9.2 | v158.27,25.72 v187.17,25.72 | LCD.1 228.03,102.56 arc45 225.49,101.51 224.62,100.64 arc45 222.73,96.06 222.73,54.38 arc45 224.59,49.89 arc-45 226.54,45.18 226.54,42.86 | C45.1 212.57,147 212.57,126.46 arc45 v215.11,120.33 | v99.54,192.72 v91.92,192.72 | J4.1 J4.2 | J5.1 J5.2 | J6.1 J6.2 | J2.2 J2.1
  Bottom 0.61: LPT.19 137.64,210.5 | LPT.22 145.89,210.5 | LPT.23 148.75,210.5 | LPT.25 154.15,210.5 | 134.78,210.5 LPT.18 | 157.96,219.39 134.78,219.39 119.86,219.39 IC2.10 | C12.1 110.97,214.31 | C11.2 C10.1 | 68.1,205.58 C15.2 | 68.1,205.58 68.1,209.23 COM1.G1 68.1,209.37 68.1,210.5 68.1,213.04 70.64,215.58 93.03,215.58 93.01,215.56 COM1.G2 93.03,209.23 91.76,207.96 COM1.5 | IC3.15 75.41,204.79 74.61,205.58 68.1,205.58 | 187.17,209.23 COM2.G1 | 187.17,205.58 C20.2 | 187.17,209.23 187.17,205.58 | IC4.15 194.79,204.79 193.99,205.58 187.17,205.58 | 212.57,209.23 COM2.G2 | COM2.5 212.57,207.96 212.57,209.23 | 187.17,209.23 187.17,213.04 187.17,215.58 212.57,215.58 212.57,209.23
  Bottom 0.813: C14.1 105.89,171.13 108.43,171.13 | 108.43,171.13 113.51,171.13 117.32,171.13 C11.2 | 108.43,171.13 C13.1 | C19.1 90.65,191.45 v91.92,192.72 | 103.35,192.72 v99.54,192.72
  Bottom 1.016: LPT.25 LPT.24 LPT.23 LPT.22 LPT.21 LPT.20 LPT.19 134.78,210.5 134.78,219.39 | GLCD.1 285.48,121.6 arc90 288.02,119.06 309.92,119.06 arc-45 315,116.96 R30.E v322.42,115.25 | LCD.1 227.8,102.56 224,106.36 R29.E | IC8.8 235.43,37.78 | 235.43,37.78 235.43,27.62 IC8.13 | 311.63,28.89 311.63,18.73 IC7.8 | 311.63,28.89 IC7.13 352.27,28.89 | 311.63,28.89 C29.1 | 143.99,149.54 R118.E 127.48,152.08 126.21,153.35 124.94,153.35 | 143.99,149.54 146.53,149.54 U1.63 | U1.63 146.53,141.92 | U1.63 C2.2 C3.2 171.93,141.92 | 171.93,141.92 U1.53 | U1.22 C1.2 156.69,102.55 150.34,102.55 C4.2 | U1.24 U1.23 U1.22 | U1.22 C28.2 156.69,84.77 Z2.A 137.64,84.77 | 100.81,149.54 C47.1 C50.1 105.89,150.81 C49.2 113.51,153.35 | 100.81,149.54 C48.1 | IC9.5 60.17,206.69 C32.1 44.93,206.69 | 44.93,206.69 C31.2 | IC10.4 C35.1 4.29,171.13 LDAC.1 | IC10.4 R97.1 R98.1 4.29,166.05 4.29,154.62 | IC10.4 12.65,171.13 arc90 14.45,172.93 C34.1 C33.2 5.56,183.83 5.56,188.91 28.42,188.91 C6.1 44.93,195.26 | JP6.1 JP7.2 55.09,171.13 50.01,171.13 50.01,186.69 R88.1 | 205.9,179.03 S41.4 203.04,179.03 | 205.9,161.29 205.9,152.4 203.68,152.4 | 205.9,161.29 205.9,170.18 | 205.9,170.18 205.9,179.03 | 203.68,152.4 203.04,152.4 203.04,152.36 | 203.04,152.36 S38.4 | 203.04,152.36 S38.3 192.56,152.36 | 203.04,161.25 S39.4 205.9,161.25 205.9,161.29 | 203.04,161.25 S39.3 | 203.04,161.25 203.04,161.29 | 203.04,170.14 S40.4 205.9,170.14 205.9,170.18 | 203.04,170.14 S40.3 | 203.04,170.14 203.04,170.18 | 203.04,179.03 S41.3 | 203.04,179.03 203.04,179.07 | 205.9,179.03 205.9,184.79 208.76,187.64 C24.1 | 192.56,152.36 C40.1 | 150.34,182.56 141.45,182.56 C52.2 | 150.34,182.56 C54.1 156.69,182.56 C37.1 C39.1
  Bottom 1.016: 150.34,182.56 R120.1 R100.E 161.77,200.34 157.96,204.15 157.96,219.39 | 124.94,153.35 R118.S 124.94,162.24 arc-90 C42.1 | PH1.2 C43.1 143.99,149.54 | 113.51,160.97 113.51,153.35 | 113.51,160.97 R116.1 113.51,171.13 | 113.51,153.35 124.94,153.35 | 113.51,160.97 C46.1 | 100.81,149.54 C44.1 | 189.07,152.36 186.57,152.36 D4.C R105.2 172.24,152.4 171.93,152.08 | 189.07,152.36 192.56,152.36 | C38.2 171.93,157.48 171.93,152.08 | 171.93,141.92 171.93,152.08 | 189.07,152.36 189.07,162.24 C36.2 | 180.82,219.39 183.36,219.39 187.17,215.58 | C20.2 174.47,202.88 R107.E | R88.1 46.2,186.37 | 44.93,195.26 46.2,195.26 R88.1 | PS2.3 233.75,202.98 234.16,202.96 | 234.16,202.96 C61.2 | R132.1 30.96,27.62 | R132.1 R133.1 43.66,27.62 | 30.96,34.29 C59.1 | 30.96,27.62 30.96,34.29 | 30.96,34.29 Z3.A | R131.1 38.58,30.16 R132.1 | C60.2 33.5,49.21 34.77,47.94 43.66,47.94 43.66,27.62 | 124.94,59.37 IC5.1 IC5.2 IC5.3 IC5.4 136.37,61.91 C27.2 C26.1 | 124.94,59.37 C25.2 | C26.1 155.42,61.91 IC6.4 | C26.1 J1.2 J1.1 136.84,53.02 | 124.94,84.77 137.64,84.77 | 124.94,84.77 RST.2 | 137.64,84.77 Z1.A | IC14.GND C57.2 32.23,22.54 | C56.2 C55.1 LED17.K 46.2,1.91 1.75,1.91 1.75,95.57 | 32.23,22.54 30.96,23.81 30.96,27.62 | 345.92,152.08 R136.1 | 345.92,152.08 C.2 351,180.66 U$1.GND | 345.92,152.08 345.92,125.57 343.38,123.03 JP4.3 343.38,115.25 | C63.2 335.76,13.65 TR2.2 | C71.2 C70.2 11.91,154.6 PDAC.2 4.29,154.62 | 343.38,66.99 C41.2 | 343.38,66.99 JP2.3 343.38,77.15 345.92,79.69 345.92,100.02 | 343.38,66.99 IC12.1 | 119.22,37.78 R145.1 | 119.22,37.78 Q15.3 108.59,34.13 103.35,28.89 JP27.1 | 134.46,37.78 R146.1 133.03,37.78 | Q16.3 134.46,37.78 | C56.2 58.9,17.78 58.9,17.46
  Bottom 1.016: 58.9,17.46 TR1.1 | C56.2 46.2,25.08 43.66,27.62 | PWR3.2 151.61,4.76 151.61,17.46 JP5.3 v158.27,25.72 B2.- 152.56,31.75 145.26,40.32 137.64,40.32 | 235.43,37.78 C30.1 | C68.2 arc90 193.83,17.62 OK1.5 C67.1 190.34,18.09 arc-45 187.17,25.77 | 187.17,25.77 JP8.1 | C62.2 336.06,23.81 arc90 333.22,20.97 | 345.92,106.39 PWR4.2 | 345.92,106.39 arc-90 343.38,108.93 343.38,115.25 | 343.38,115.25 v333.22,115.25 | 345.92,100.02 268.45,100.01 arc-90 268.44,100.02 LCD.16 268.45,106.36 245.59,106.36 | 345.92,100.02 345.92,106.39 | LCD.5 | LCD.5 | 240.51,106.36 245.59,106.36 | 240.51,106.36 LCD.5 | LCD.9 LCD.8 | LCD.9 LCD.10 | LCD.9 | LCD.8 LCD.7 | LCD.8 | LCD.7 | LCD.7 | 245.59,106.36 LCD.7 | GLCD.20 237.22,122.19 237.17,122.24 237.17,119.06 | 240.51,106.36 240.51,108.57 arc45 238.7,112.93 arc-45 237.17,116.62 237.17,119.06 | 212.57,215.58 212.57,207.96 218.92,207.96 218.92,202.88 234.16,202.88 234.16,202.96 | 187.17,213.04 PWR2.2 | 1.75,95.57 1.75,107.63 1.77,107.61 PWR1.2 1.75,107.61 1.75,139.38 | 1.75,139.38 1.75,154.62 4.29,154.62 | 1.75,139.38 JP1.3 | 119.22,37.78 119.22,39.69 122.4,42.86 122.4,53.02 136.84,53.02 | 137.64,40.32 137,40.32 134.46,37.78 | OK2.2 58.9,35.24 58.9,17.46 | JP17.3 21.43,19.37 22.7,21.91 32.23,22.54 | 124.94,84.77 122.4,84.77 122.4,59.37 124.94,59.37 | 44.93,195.26 44.93,206.69 | 1.75,95.57 JP3.3 | v187.17,25.72 187.17,25.77 | v215.11,120.33 216.38,119.06 237.17,119.06 | 203.68,152.4 J3.1 | 93.03,209.23 99.7,209.23 99.7,196.37 103.35,192.72 103.35,182.56 C14.1 | 136.84,53.02 137.64,53.02 137.64,40.32
  Bottom 1.27: B1.- C5.2 18.26,200.34 22.07,204.15 R2.1 28.42,206.69 | C6.1 IC1.GND 28.42,206.69 | 28.42,206.69 C7.2 C8.2 C9.1 | IC9.5 68.1,210.5
  Bottom 1.778: C62.2 RE1.2 352.27,28.89 RE1.3 C64.2
  pour Bottom (isolate 0.813, no thermals): 370.05,227.01 370.05,-4.13 231.62,-5.4 231.62,23.81 198.6,23.81 199.23,-6.67 142.72,-6.03 142.72,26.35 112.24,26.35 111.6,-6.03 -5.24,-6.67 -5.87,227.01
  pour Top (isolate 0.762, no thermals, hatched): 130.65,149.54 195.42,149.54 195.42,84.77 130.65,84.77
  pour Top (isolate 0.762, no thermals, hatched): 223.04,189.55 316.07,189.55 316.07,119.7 223.04,119.7
  pour Top (isolate 0.762, no thermals, hatched): 220.19,105.09 318.29,105.09 318.29,45.08 220.19,45.08
  pour Top (isolate 0.762, no thermals, hatched): 240.82,43.18 306.23,43.18 306.23,10.8 240.82,10.8
  pour Top (isolate 0.762, no thermals, hatched): 308.77,37.78 317.02,37.78 317.02,17.46 308.77,17.46
  pour Top (isolate 0.762, no thermals, hatched): 316.71,218.76 359.25,218.76 359.25,156.84 315.75,156.84 316.07,189.23 316.39,189.55 316.39,218.44
  pour Top (isolate 0.762, no thermals, hatched): 184.31,206.06 184.31,220.66 215.42,220.66 215.42,206.06
  pour Top (isolate 0.762, no thermals, hatched): 112.24,220.98 112.24,206.06 165.26,206.06 165.26,220.66 112.55,220.66
  pour Top (isolate 0.762, no thermals, hatched): 64.93,220.66 64.93,206.06 95.73,206.06 95.73,220.66
  pour Top (isolate 0.762, no thermals, hatched): 0.16,26.99 0.16,56.2 23.65,56.2 23.65,26.99
  pour Top (isolate 0.762, no thermals, hatched): 355.12,55.56 355.12,16.19 347.19,16.19 347.19,55.56
  pour Top (isolate 0.762, no thermals, hatched): 340.84,10.48 340.84,6.67 328.14,6.67 328.14,10.48
  pour Top (isolate 0.762, no thermals, hatched): 10.95,165.42 10.64,182.25 9.68,183.2 9.68,184.47 15.8,184.47 arc-90 19.84,180.43 19.84,165.42
  pour Top (isolate 0.762, no thermals, hatched): 123.98,68.26 156.69,68.26 156.69,51.44 123.67,51.44 123.67,68.26
  pour Top (isolate 0.762, no thermals, hatched): 62.71,202.88 49.96,202.88 46.83,206.01 46.83,210.5 62.71,210.5
  pour Top (isolate 0.762, no thermals, hatched): 137.64,186.37 147.48,186.37 147.48,173.99 137.64,173.99
GROUP-A1
  Bottom 1.016: JP21.2 arc90 125.41,42.39 R143.1
GROUP-A2
  Bottom 1.016: R144.1 140.65,42.39 arc-90 JP22.2
INT0
  Bottom 1.016: 150.34,72.07 S33.4 | 150.34,72.07 IC6.7 | R32.1 150.34,72.07
IR
  Bottom 1.016: IC14.OUT R123.1 JP18.1
J
  Bottom 0.406: 83.23,213.04 COM1.4
  Bottom 0.61: 81.76,213.04 81.99,213.04
  Bottom 1.016: COM1.1 75.09,207.96 arc-45 75.98,210.11 COM1.6 78.16,212.29 arc-45 79.97,213.04 81.76,213.04 83.23,213.04
K
  Bottom 0.406: 202.61,213.04 COM2.4
  Bottom 0.61: 195.74,210.5 COM2.6
  Bottom 1.016: COM2.1 194.38,208.09 arc-45 195.12,209.89 195.74,210.5 | COM2.6 arc-90 198.29,213.04 201.14,213.04 202.61,213.04
LDR
  Bottom 1.016: R112.2 C43.2 148.01,160.97 arc90 151.61,164.56 S42.16
LM35-1
  Bottom 1.016: 173.2,161.92 R102.2 | 173.2,161.92 169.23,161.92 arc-90 S42.10 | 173.2,161.92 173.51,161.92 arc-37 C38.1
LM35-2
  Bottom 1.016: D3.A IC11.3 171.93,167.32 arc90 S42.9
ML1
  Top 0.813: 296.39,36.51 M1.9
  Top 1.016: M2.9 271.86,33.1 arc45 275.88,31.43 285.88,31.43 arc45 289.72,33.02 292.44,35.75 arc-45 294.3,36.51 296.39,36.51
  Bottom 1.016: M2.9 265.91,39.7 arc45 264.57,42.93 Q6.3
ML2
  Top 1.016: M2.14 253.21,39.15 arc-45 254.04,41.15 255.35,42.47 arc-45 259.37,44.13 278.91,44.13 arc45 282.72,45.71 Q7.3 arc-90 286.23,44.13 M1.14
ML3
  Top 1.016: Q8.3 arc-90 301.47,44.13 301.47,26.26 arc-45 300.63,24.25 299.76,23.37 arc45 298.93,21.37 M1.8 298.93,12.03 arc-90 294.52,7.62 270.32,7.62 arc-90 265.91,12.03 M2.8
ML4
  Top 1.016: M2.12 258.29,40.32 arc-90 259.56,41.59 264.55,41.59 arc-45 269.04,39.73 273.46,35.31 arc45 276.69,33.97 285.83,33.97 arc45 288.67,35.15 290.41,36.88 arc45 M1.12 Q9.3
ML5
  Bottom 0.813: M1.1 arc-90 278.92,12.7 250.35,12.7 arc-90 M2.1
  Bottom 1.016: M1.1 281.15,27.64 arc45 278.46,34.11 278.42,34.16 arc-45 276.07,39.84 Q10.3
ML6
  Top 1.016: M2.7 arc-90 265.59,17.14 265.91,17.14 arc-90 268.45,14.6 arc90 273.53,10.16 292.26,10.16 arc90 M1.7
  Bottom 1.016: Q11.3 268.45,26.07 arc-45 265.95,20.05 265.03,19.13 arc45 263.37,15.11 M2.7
ML7
  Top 1.016: Q12.3 arc90 243.05,44.13 243.05,22.04 arc90 247.63,17.46 248.87,17.46 arc-90 250.67,15.67 M2.2
  Bottom 0.813: M1.2 283.69,13.33 arc-90 281.15,10.8 249.4,10.8 arc-90 245.59,14.6 245.59,15.67 arc-90 247.38,17.46 248.87,17.46 arc-90 250.67,15.67 M2.2
ML8
  Top 1.016: M2.5 258.29,19.05 | 258.29,19.05 268.45,19.05 arc-90 270.99,16.51 270.99,15.24 arc90 273.53,12.7 289.08,12.7 arc90 M1.5 | 258.29,19.05 arc-90 253.21,24.13 253.21,24.86 arc45 249.01,34.99 246.52,37.49 arc-45 245.59,39.73 245.59,40.54 arc-90 249.18,44.13 250.67,44.13 arc90 Q13.3
MULTI_SW
  Bottom 1.016: 192.56,176.21 R104.2 R103.2 C40.2 | 192.56,176.21 R108.2 R109.2 R101.S | 192.56,176.21 R101.E 187.17,176.26 arc90 183.56,179.87 arc45 179.51,177.45 176.23,171.52 arc-61 173.41,169.86 169.39,169.86 arc90 S42.11
N$1
  Bottom 1.016: R49.2 IC7.7
N$2
  Bottom 1.27: 14.45,213.04 PWR.-
  Bottom 1.676: B1.AC2 6.39,196.97 arc-45 5.56,198.98 5.56,201.31 arc-90 8.4,204.15 15.93,204.15 arc90 19.53,207.74 19.53,207.96 arc90 14.45,213.04
N$3
  Bottom 1.676: IC1.IN D1.C C6.2 C5.1 14.35,192.63 arc-45 11.51,191.45 5.86,191.45 arc-90 3.02,194.29 B1.+
N$4
  Bottom 1.27: R2.2 21.57,214.58 arc-29 21.11,216.39 LED1.K
N$5
  Bottom 1.016: R3.2 104.62,202.88 arc-90 101.44,206.06 101.44,208.01 arc-45 102.76,211.18 LED2.K
N$6
  Bottom 1.016: JP1.2 arc-90 8.73,136.21 RN1.1
N$7
  Bottom 1.016: JP3.2 11.91,94.19 arc-90 10.11,92.39 RN3.1
N$8
  Bottom 1.016: S4.9 RN3.2
N$9
  Bottom 1.016: S14.4 67.35,141.92 73.3,141.92 S14.3 73.58,141.92 73.84,141.92 arc90 76.68,144.76 76.68,149.54 | 70.33,164.78 JP6.2 | S13.4 67.35,149.54 73.3,149.54 S13.3 73.58,149.54 76.68,149.54 | S8.4 67.35,157.16 73.3,157.16 S8.3 73.58,157.16 76.68,157.16 | S7.4 67.35,164.78 70.33,164.78 | 70.33,164.78 73.3,164.78 S7.3 73.86,164.78 arc-90 76.68,161.96 76.68,157.16 | 76.68,149.54 76.68,157.16
N$10
  Bottom 1.016: C18.1 74.04,191.55 arc-45 72.87,194.39 IC3.1
N$11
  Bottom 0.813: 186.53,55.84 S30.3 | S30.4 186.53,55.84 | 186.53,55.84 186.53,55.88 | S29.4 192.92,48.22 192.88,48.26 192.84,48.22 S29.3 | 193.16,40.6 S24.4 | 193.16,40.6 S24.3 | 193.2,40.64 193.16,40.6 | S19.4 192.92,32.98 192.88,33.02 192.84,32.98 189.71,32.98 S19.3
  Bottom 1.016: 184.31,40.64 184.31,48.26 | 184.31,48.26 184.31,53.96 arc-90 186.19,55.84 S30.4 | S19.3 186.53,32.98 186.53,33.02 arc-90 184.31,35.24 184.31,40.64 | 184.31,40.64 193.2,40.64 | S29.4 184.31,48.22 184.31,48.26 | JP8.2 189.71,32.98
N$12
  Bottom 1.016: S2.9 RN1.2
N$13
  Bottom 1.016: S2.10 RN1.3
N$14
  Bottom 1.016: S2.11 RN1.4
N$15
  Bottom 1.016: S2.12 RN1.5
N$16
  Bottom 1.016: S2.13 RN1.6
N$17
  Bottom 1.016: S2.14 RN1.7
N$18
  Bottom 1.016: S2.15 RN1.8
N$19
  Bottom 1.016: S2.16 RN1.9
N$20
  Bottom 1.016: S4.10 RN3.3
N$21
  Bottom 1.016: S4.11 RN3.4
N$22
  Bottom 1.016: S4.12 RN3.5
N$23
  Bottom 1.016: S4.13 RN3.6
N$24
  Bottom 1.016: S4.14 RN3.7
N$25
  Bottom 1.016: S4.15 RN3.8
N$26
  Bottom 1.016: S4.16 RN3.9
N$27
  Bottom 0.813: RN5.1 161.77,12.19 arc90 159.04,14.92 JP5.2
N$28
  Bottom 1.016: RN5.2 S6.9
N$29
  Bottom 1.016: RN5.3 S6.10
N$30
  Bottom 1.016: RN5.4 S6.11
N$31
  Bottom 1.016: RN5.5 S6.12
N$32
  Bottom 1.016: RN5.6 S6.13
N$33
  Bottom 1.016: RN5.7 S6.14
N$34
  Bottom 1.016: RN5.8 S6.15
N$35
  Bottom 1.016: RN5.9 S6.16
N$36
  Bottom 1.016: S10.1 70.33,92.34 | 70.33,92.34 S9.2 | 70.33,92.34 70.33,92.39
N$37
  Bottom 1.016: 88.11,92.34 S11.1 | S10.2 88.11,92.34 | 88.11,92.34 88.11,92.39
N$38
  Bottom 1.016: 105.89,92.34 S12.1 | S11.2 105.89,92.34 | 105.89,92.34 105.89,92.39
N$39
  Bottom 1.016: 65.25,64.4 S20.2 | S21.1 65.25,64.4 | 65.25,64.4 65.25,64.45
N$40
  Bottom 1.016: 83.03,64.4 S21.2 | S22.1 83.03,64.4 | 83.03,64.4 83.03,64.45
N$41
  Bottom 1.016: 105.89,64.4 S23.1 | 105.89,64.4 S22.2 | 105.89,64.45 105.89,64.4
N$42
  Bottom 1.016: JP4.2 345.92,122.09 arc-90 347.34,123.51 RN4.1
N$43
  Bottom 1.016: S5.9 RN4.2
N$44
  Bottom 1.016: S5.10 RN4.3
N$45
  Bottom 1.016: S5.11 RN4.4
N$46
  Bottom 1.016: S5.12 RN4.5
N$47
  Bottom 1.016: S5.13 RN4.6
N$48
  Bottom 1.016: S5.14 RN4.7
N$49
  Bottom 1.016: S5.15 RN4.8
N$50
  Bottom 1.016: S5.16 RN4.9
N$51
  Bottom 1.016: RN2.1 347.71,77.15 arc90 345.92,75.36 JP2.2
N$52
  Bottom 1.016: S3.9 RN2.2
N$53
  Bottom 1.016: S3.10 RN2.3
N$54
  Bottom 1.016: S3.11 RN2.4
N$55
  Bottom 1.016: S3.12 RN2.5
N$56
  Bottom 1.016: S3.13 RN2.6
N$57
  Bottom 1.016: S3.14 RN2.7
N$58
  Bottom 1.016: S3.15 RN2.8
N$59
  Bottom 1.016: S3.16 RN2.9
N$60
  Bottom 1.016: 65.25,78.37 S15.2 | S16.1 65.25,78.37 | 65.25,78.37 65.25,78.42
N$61
  Bottom 1.016: 83.03,78.37 S16.2 | S17.1 83.03,78.37 | 83.03,78.37 83.03,78.42
N$62
  Bottom 1.016: 105.89,78.37 S18.1 | S17.2 105.89,78.37 | 105.89,78.37 105.89,78.42
N$63
  Bottom 1.016: C18.2 76.89,191.67 arc45 77.95,194.21 IC3.3
N$64
  Bottom 1.016: C17.1 IC3.4
N$65
  Bottom 1.016: 65.25,50.43 S25.2 | S26.1 65.25,50.43 | 65.25,50.43 65.25,50.48
N$66
  Bottom 1.016: 83.03,50.43 S26.2 | S27.1 83.03,50.43 | 83.03,50.43 83.03,50.48
N$67
  Bottom 1.016: S9.4 64.6,87.36 arc90 58.9,81.66 58.9,77.93 arc-90 54.36,73.39 S15.3
N$68
  Bottom 1.016: S10.4 82.06,87.36 arc45 79.37,86.25 77.79,84.67 arc45 76.68,81.98 76.68,78.73 arc-45 75.56,76.04 74.03,74.51 arc-45 71.34,73.39 S16.3
N$69
  Bottom 1.016: S17.3 89.07,73.39 arc45 91.76,74.51 93.34,76.09 arc45 94.46,78.78 94.46,81.98 arc-45 95.57,84.67 97.15,86.25 arc-45 99.84,87.36 S11.4
N$70
  Bottom 1.016: S12.4 117.62,87.36 arc45 114.93,86.25 113.35,84.67 arc45 112.24,81.98 112.24,78.73 arc-45 111.12,76.04 109.54,74.46 arc-45 106.85,73.34 105.94,73.34 | 105.89,73.34 105.94,73.34 | 105.94,73.34 S18.3
N$71
  Bottom 1.016: S28.1 105.89,50.43 | 105.89,50.43 S27.2 | 105.89,50.43 105.89,50.48
N$72
  Bottom 1.016: C17.2 IC3.5
N$73
  Bottom 1.016: S25.3 52.55,45.45 52.55,45.4 53.51,45.4 arc45 56.2,46.52 57.78,48.1 arc45 58.9,50.79 58.9,54.04 arc-45 60.01,56.73 61.59,58.31 arc-45 64.28,59.42 S20.4
N$74
  Bottom 1.016: S26.3 70.33,45.45 70.33,45.4 71.29,45.4 arc45 73.98,46.52 75.56,48.1 arc45 76.68,50.79 76.68,54.04 arc-45 77.79,56.73 79.37,58.31 arc-45 82.06,59.42 S21.4
N$75
  Bottom 1.016: S22.4 99.84,59.42 arc45 97.15,58.31 95.57,56.73 arc45 94.46,54.04 94.46,50.79 arc-45 93.34,48.1 91.76,46.52 arc-45 89.07,45.4 88.11,45.4 88.11,45.45 S27.3
N$76
  Bottom 1.016: S23.4 118.43,59.37 117.62,59.37 arc45 114.93,58.26 113.35,56.68 arc45 112.24,53.98 112.24,50.79 arc-45 111.12,48.1 109.54,46.52 arc-45 106.85,45.4 105.94,45.4 | 105.94,45.4 105.89,45.4 | 105.94,45.4 S28.3
N$77
  Bottom 1.016: S15.4 65.2,73.39 65.25,73.34 64.07,73.34 arc45 61.37,72.23 60.01,70.87 arc45 58.9,68.17 58.9,64.76 arc-45 57.78,62.07 56.25,60.54 arc-45 53.56,59.42 S20.3
N$78
  Bottom 1.016: S16.4 81.88,73.39 arc45 79.19,72.28 77.79,70.88 arc45 76.68,68.19 76.68,64.76 arc-45 75.56,62.07 73.98,60.49 arc-45 71.29,59.37 70.33,59.37 70.38,59.42 S21.3
N$79
  Bottom 1.016: S17.4 99.66,73.39 arc45 96.97,72.28 95.57,70.88 arc45 94.46,68.19 94.46,64.76 arc-45 93.34,62.07 91.76,60.49 arc-45 89.07,59.37 88.11,59.37 88.16,59.42 S22.3
N$80
  Bottom 1.016: S18.4 117.44,73.39 arc45 114.75,72.28 113.35,70.88 arc45 112.24,68.19 112.24,64.76 arc-45 111.12,62.07 109.54,60.49 arc-45 106.85,59.37 105.89,59.37 105.94,59.42 S23.3
N$81
  Bottom 1.016: C19.2 86.74,191.55 arc-45 85.57,194.39 IC3.6
N$82
  Bottom 1.016: IC3.2 75.41,196.01 arc90 73.61,197.8 72.34,197.8 arc45 71.07,197.28 69.73,195.94 arc-45 C16.1
N$83
  Bottom 0.61: IC3.9 92.1,202.88 arc-90 96.36,198.62 96.36,191.51 arc45 96.97,190.05 97.89,189.13 arc-45 98.27,188.22 S31.1
N$84
  Bottom 0.61: IC3.12 arc-45 83.58,204.23 84.24,204.89 arc-45 85.92,205.58 92.55,205.58 arc-90 97.63,200.5 97.63,192.78 arc45 98.24,191.32 99.23,190.33 arc-45 100.17,188.06 100.17,187.1 arc-90 98.17,185.1 arc-45 96.16,185.93 96.1,186 arc-45 95.73,186.9 S31.2
N$85
  Bottom 0.61: IC3.10 88.11,202.14 arc90 89.9,200.34 92.8,200.34 arc-90 95.09,198.05 95.09,191.82 arc-45 94.27,189.84 93.97,189.54 arc45 S31.3
N$86
  Bottom 0.61: IC3.11 85.57,201.91 arc90 88.41,199.07 92.4,199.07 arc-90 93.82,197.65 93.82,193.43 arc-45 92.87,191.14 91.48,189.74 arc45 90.65,187.74 S31.4
N$87
  Bottom 1.016: C23.1 arc-45 192.25,194.52 IC4.1
N$88
  Bottom 1.016: C23.2 arc45 197.33,194.52 IC4.3
N$89
  Bottom 1.016: C22.1 IC4.4
N$90
  Bottom 1.016: C22.2 IC4.5
N$91
  Bottom 1.016: C24.2 206.12,191.55 arc-45 204.95,194.39 IC4.6
N$92
  Bottom 1.016: C21.1 arc45 189.33,196.16 190.45,197.28 arc-45 191.72,197.8 192.99,197.8 arc-90 194.79,196.01 IC4.2
N$93
  Bottom 0.61: IC4.9 212.57,202.88 arc-90 215.11,200.34 215.11,195.04 arc45 215.85,193.25 218.17,190.93 arc-45 218.92,189.13 S32.1
N$94
  Bottom 0.61: S32.2 216.38,187.12 arc45 216.9,185.85 arc45 218.7,185.1 219.66,185.1 arc90 221.46,186.9 221.46,188.01 arc45 219.92,191.72 217.12,194.52 arc-45 216.38,196.31 216.38,201.83 arc90 212.78,205.42 204.73,205.42 arc45 202.93,204.68 arc45 202.41,203.41 IC4.12
N$95
  Bottom 0.61: IC4.10 arc90 210.03,200.34 211.3,200.34 arc-90 213.84,197.8 S32.3
N$96
  Bottom 0.61: S32.4 211.3,191.98 arc-45 211.82,193.25 arc45 212.57,195.04 212.57,196.53 arc90 210.03,199.07 207.49,199.07 arc-90 204.95,201.61 IC4.11
N$97
  Bottom 1.016: LED11.K R25.2
N$98
  Top 0.813: 19.88,42.51 arc45 23.24,41.12 S44.S2
  Top 1.016: R134.2 13.18,51.89 arc45 15.07,47.32 19.88,42.51
N$99
  Bottom 1.016: LED18.K R134.1
N$100
  Top 1.016: S44.S1 24.72,57.99 R135.2
N$101
  Bottom 1.016: LED19.K R135.1
N$102
  Top 1.016: S44.5 26.04,45.24 27.78,44.77 R128.1
  Bottom 1.016: R128.1 R131.2
N$103
  Top 1.016: S44.2 38.54,37.74 R132.2
  Bottom 1.016: R129.1 R132.2
N$104
  Top 1.016: R133.2 37.73,34.61 arc45 35.38,33.64 34.15,32.4 arc-45 32.58,31.75 31.95,31.75 arc-43 30.22,32.42 27.96,34.5 arc43 26.04,35.24 24.61,35.24 S44.1
  Bottom 1.016: R130.1 R133.2
N$105  (via drill 0.6 pad 1.68)
  Top 0.813: 26.99,50.32 S44.7
  Top 1.016: 30.69,54.03 v30.64,53.97 26.99,50.32
  Bottom 1.016: S43.1 arc45 31.33,54.66 v30.64,53.97
N$106
  Bottom 1.016: DSP1.11 264.64,210.06 arc-45 262.25,204.31 259.4,201.45 arc45 257.02,195.7 R39.2
N$107
  Bottom 1.016: S43.4 R130.2
N$108
  Bottom 1.016: S43.3 R129.2
N$109
  Bottom 1.016: S43.2 R128.2
N$110
  Bottom 1.016: R40.2 277.34,209.87 arc90 DSP1.7
N$111
  Bottom 1.016: R41.2 DSP1.4
N$112
  Bottom 1.016: R42.2 DSP1.2
N$113
  Bottom 1.016: R43.2 DSP1.1
N$114
  Bottom 1.016: R44.2 259.56,195.17 arc-45 261.42,199.66 264.79,203.04 arc45 267.18,208.79 DSP1.10
N$115
  Bottom 1.016: R45.2 DSP1.5
N$116
  Bottom 1.016: R46.2 DSP1.3
N$117
  Bottom 1.016: R36.1 304.01,214.31 arc-90 301.47,211.77 296.69,211.77 arc90 293.85,208.93 293.85,205.95 arc-90 292.05,204.15 Q3.2
N$118
  Bottom 1.016: Q2.2 281.15,204.15 arc90 283.69,206.69 283.69,211.77 arc-90 286.23,214.31 298.93,214.31 arc90 R35.1
N$119
  Top 1.016: R38.1 298.93,216.35 arc-90 294.35,211.77 281.38,211.77 arc45 277.52,210.17 274.8,207.45 272.22,204.9 arc-45 270.4,204.15 Q5.2
N$120
  Bottom 1.016: R37.1 267.2,216.85 arc45 258.71,213.34 254.24,208.87 arc45 252.89,205.6 arc90 254.33,204.15 Q4.2
N$121
  Bottom 1.016: S34.4 R37.2
N$122
  Bottom 1.016: S34.3 R38.2
N$123
  Bottom 1.016: S34.2 R35.2
N$124
  Bottom 1.016: S34.1 R36.2
N$125